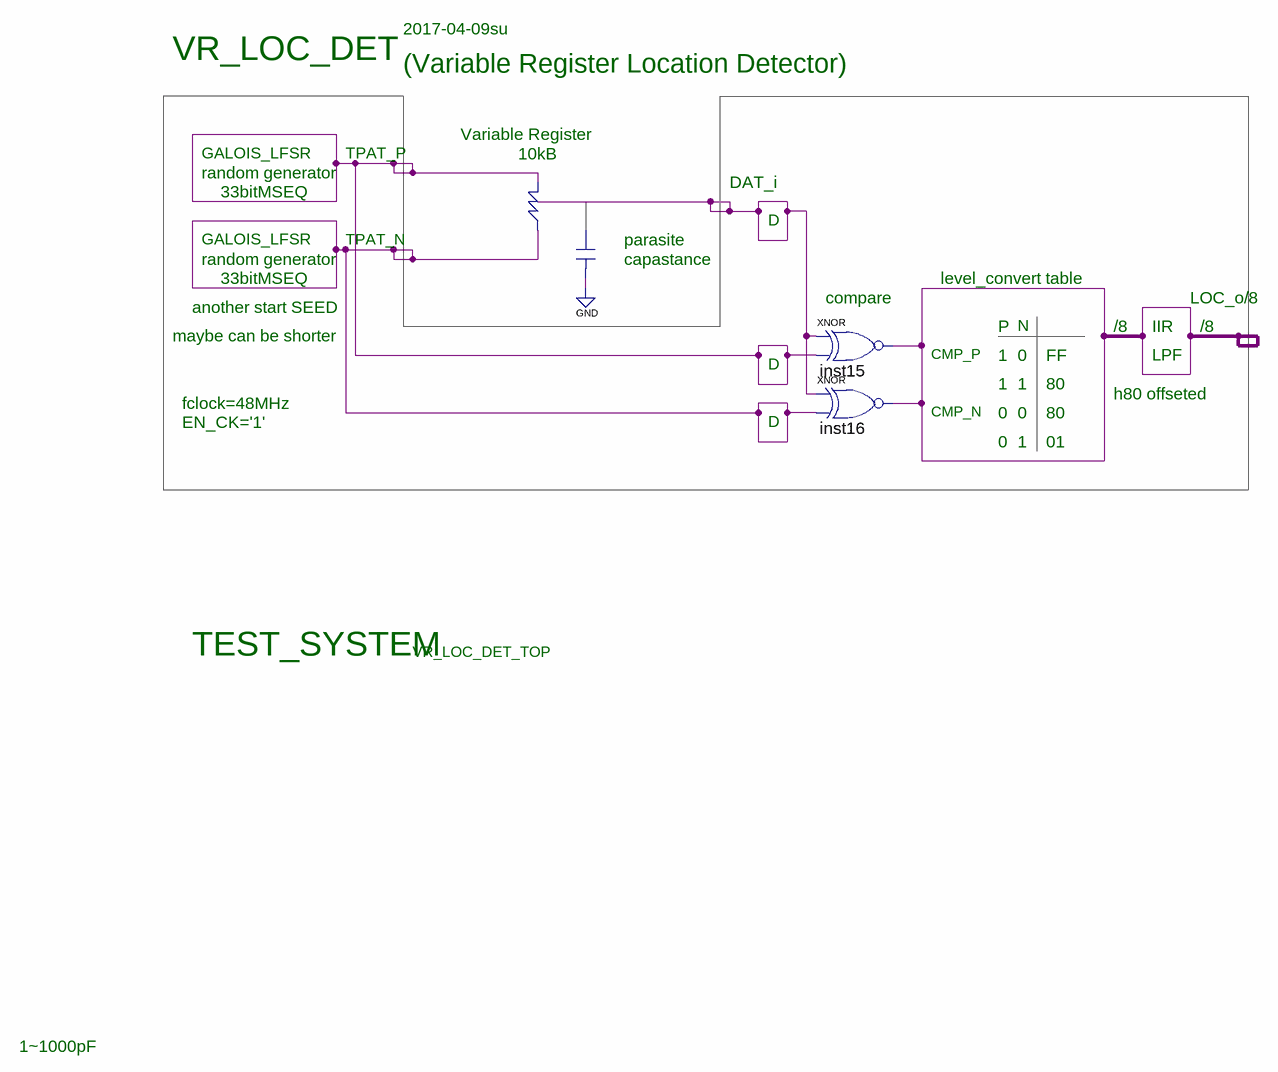
[diagram p0: schematic sheet]
// Quartus schematic VR_LOC_DET.bdf as structural Verilog: 4 symbols, 0 pins
module VR_LOC_DET (
);

  wire inst12_y, inst13_y, inst15_out, undriven, undriven_2;

  R inst12 (.A(undriven), .Y(inst12_y));
  c inst13 (.Y(inst13_y));  // open: A
  xnor inst15 (inst15_out, undriven_2, inst12_y);
  xnor inst16 (inst15_out, undriven_2, undriven);
  // also tied to GND on the sheet: inst13_y

  // Notes on the sheet:
  //   2017-04-09su
  //   VR_LOC_DET
  //   (Variable Register Location Detector)
  //   Variable Register
  //   GALOIS_LFSR
  //   TPAT_P
  //   10kB
  //   random generator
  //   DAT_i
  //   33bitMSEQ
  //   D
  //   GALOIS_LFSR
  //   TPAT_N
  //   parasite
  //   random generator
  //   capastance
  //   33bitMSEQ
  //   level_convert table
  //   compare
  //   LOC_o/8
  //   another start SEED
  //   P
  //   N
  //   /8
  //   IIR
  //   /8
  //   maybe can be shorter
  //   CMP_P
  //   1
  //   0
  //   FF
  //   LPF
  //   D
  //   1
  //   1
  //   80
  //   h80 offseted
  //   fclock=48MHz
  //   CMP_N
  //   0
  //   0
  //   80
  //   EN_CK='1'
  //   D
  //   0
  //   1
  //   01
  //   TEST_SYSTEM
  //   VR_LOC_DET_TOP
  //   1~1000pF
endmodule
